# EAGLE design LED_BOARD (EAGLE 9.6.2)
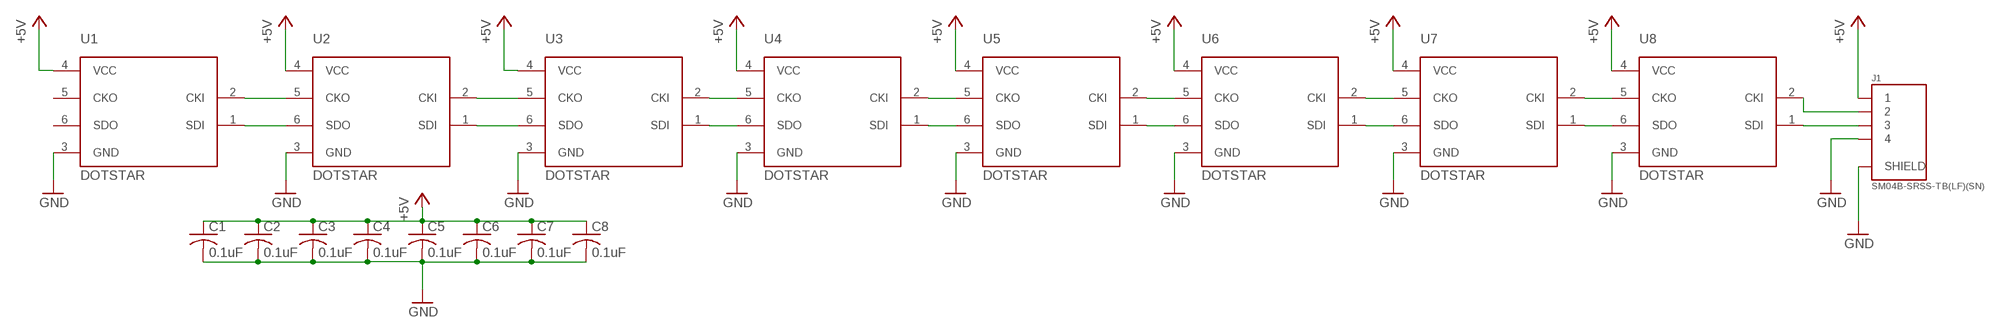
[diagram p0: schematic, sheet 1]

## Parts
C1  0.1uF  C-USC0603  [C0603]
C2  0.1uF  C-USC0603  [C0603]
C3  0.1uF  C-USC0603  [C0603]
C4  0.1uF  C-USC0603  [C0603]
C5  0.1uF  C-USC0603  [C0603]
C6  0.1uF  C-USC0603  [C0603]
C7  0.1uF  C-USC0603  [C0603]
C8  0.1uF  C-USC0603  [C0603]
J1  SM04B-SRSS-TB(LF)(SN)  [SM04B-SRSS-TB(LF)(SN)]
U1  DOTSTAR  [RGBLED5050]
U2  DOTSTAR  [RGBLED5050]
U3  DOTSTAR  [RGBLED5050]
U4  DOTSTAR  [RGBLED5050]
U5  DOTSTAR  [RGBLED5050]
U6  DOTSTAR  [RGBLED5050]
U7  DOTSTAR  [RGBLED5050]
U8  DOTSTAR  [RGBLED5050]

## Nets
+5V: C1.1 C2.1 C3.1 C4.1 C5.1 C6.1 C7.1 C8.1 J1.1 U1.4(VCC) U2.4(VCC) U3.4(VCC) U4.4(VCC) U5.4(VCC) U6.4(VCC) U7.4(VCC) U8.4(VCC)
GND: C1.2 C2.2 C3.2 C4.2 C5.2 C6.2 C7.2 C8.2 J1.4 J1.S1(SHIELD) J1.S2(SHIELD) U1.3(GND) U2.3(GND) U3.3(GND) U4.3(GND) U5.3(GND) U6.3(GND) U7.3(GND) U8.3(GND)
N$1: U1.2(CKI) U2.5(CKO)
N$2: U1.1(SDI) U2.6(SDO)
N$3: U2.2(CKI) U3.5(CKO)
N$4: U2.1(SDI) U3.6(SDO)
N$5: U3.2(CKI) U4.5(CKO)
N$6: U3.1(SDI) U4.6(SDO)
N$7: U4.2(CKI) U5.5(CKO)
N$8: U4.1(SDI) U5.6(SDO)
N$9: U5.2(CKI) U6.5(CKO)
N$10: U5.1(SDI) U6.6(SDO)
N$11: U6.2(CKI) U7.5(CKO)
N$12: U6.1(SDI) U7.6(SDO)
N$13: U7.2(CKI) U8.5(CKO)
N$14: U7.1(SDI) U8.6(SDO)
N$15: J1.2 U8.2(CKI)
N$16: J1.3 U8.1(SDI)
Unconnected: U1.5(CKO) U1.6(SDO)

## Library data of the parts
C1-C8 = rcl:C-US: CAPACITOR, American symbol; SPICEPREFIX: C
J1 = Hocki_Library:SM04B-SRSS-TB(LF)(SN): Connector Header Surface Mount, Right Angle 4 position 0.039" (1.00mm) DigiKey <https://www.digikey.com/product-detail/en/jst-sales-america-inc/SM04B-SRSS-TB-LF-SN/455-1804-1-ND/926875>; DKPN: 455-1804-1-ND
U1-U8 = LED_BOARD:DOTSTAR

## Board
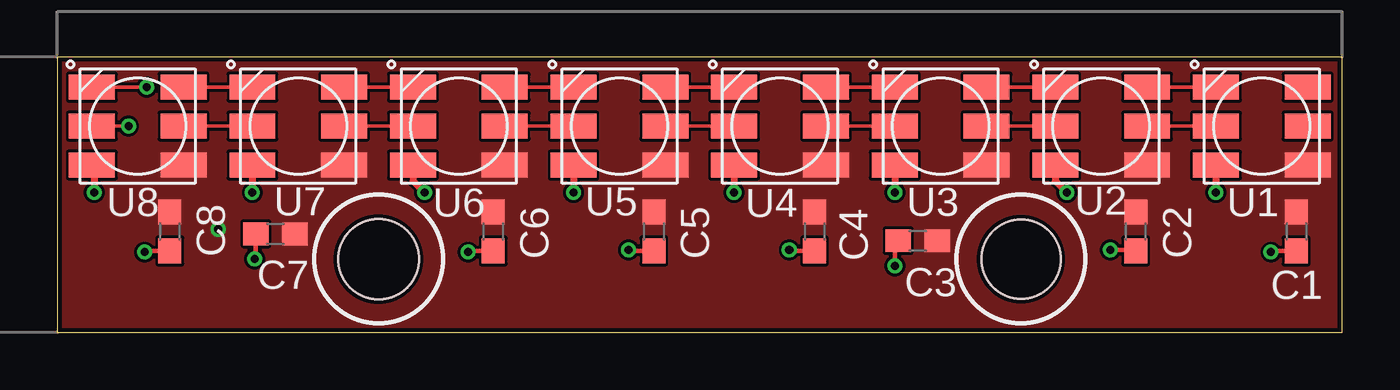
[diagram p1: board, top side]
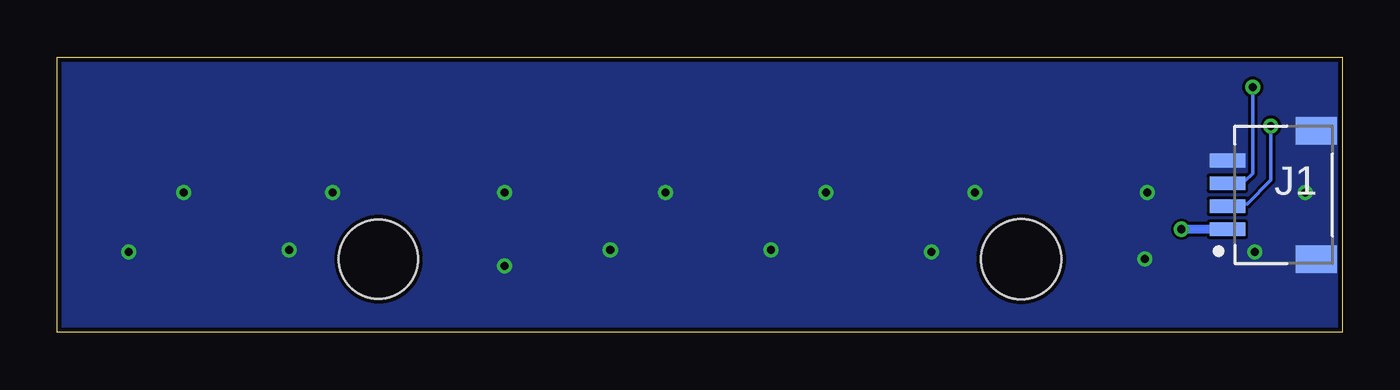
[diagram p2: board, bottom side, seen from below]

Size 56 x 12 mm. Coordinates in mm from the lower left corner, seen from the top.
Outline: 0,12 0,0 56,0 56,12 0,12
Copper layers (1+16): Top 0.035mm / dielectric 1.53mm / Bottom 0.035mm
Design rules "JLCPCB (2 Layer)": minimum track width 5mil, minimum drill 0.3mm, track to track 5mil, track to pad 5mil, pad to pad 5mil, via to via 20mil, smd to smd 5mil, copper to edge 0.2mm, drill to drill 21mil, minimum pad ring 6mil, minimum via ring 6mil, stop-mask expansion 6mil, vias tented up to drill 30mil, thermal gap 10mil
Holes 3.5 mm at 14,3.2
Holes 3.45 mm at 42,3.2

### Footprints (pad centres in the part's own frame; a part is rotated, then mirrored left to right if it is on the bottom)
C0603 = smd 1.1 x 1: 1 -0.85,0; 2 0.85,0
SM04B-SRSS-TB(LF)(SN) = smd 0.6 x 1.55: 1 -1.5,0; 2 -0.5,0; 3 0.5,0; 4 1.5,0 | smd 1.2 x 1.8: S1 -2.8,-3.875; S2 2.8,-3.875
RGBLED5050 = smd 2 x 1.1: 1 2,-1.7; 2 2,0; 3 2,1.7; 4 -2,1.7; 5 -2,0; 6 -2,-1.7

### Placement (x,y rotation side)
C1  54,4.4 270 top
C2  47,4.4 270 top
C3  37.5,4 180 top
C4  33,4.4 270 top
C5  26,4.4 270 top
C6  19,4.4 270 top
C7  9.5,4.3 180 top
C8  4.9,4.4 270 top
J1  5,6 90 bottom
U1  52.5,9 180 top
U2  45.5,9 180 top
U3  38.5,9 180 top
U4  31.5,9 180 top
U5  24.5,9 180 top
U6  17.5,9 180 top
U7  10.5,9 180 top
U8  3.5,9 180 top

### Tracks (layer width: path | path; a pad name or v marks a point on that pad's centre or on a via)
+5V  (via drill 0.35)
  Bottom 0.4: J1.1 v7,4.5
  pour Top (no thermals): 0,0 0,12 56,12 56,0
GND  (via drill 0.35)
  Top 0.2: C8.2 3.85,3.55 v3.8,3.5 | U8.3 1.6,7.2 | C1.2 52.95,3.55 v52.9,3.5 | C2.2 46.95,3.6 v45.9,3.6 | C3.2 36.5,3.85 v36.5,2.9 | C4.2 31.95,3.55 v31.9,3.6 | v24.9,3.6 24.95,3.55 C5.2 | C6.2 17.95,3.55 v17.9,3.5 | C7.2 8.65,3.3 v8.6,3.2
  Top 0.3: U1.3 v50.5,6.1 | v44,6.1 43.5,6.6 U2.3 | U3.3 v36.5,6.1 | U4.3 v29.5,6.1 | U5.3 v22.5,6.1 | U6.3 15.5,6.6 v16,6.1 | U7.3 v8.5,6.1 | 1.6,7.2 v1.6,6.1
  pour Bottom (no thermals): 56,12 56,0 0,0 0,12
N$1
  Top 0.152: U2.5 U1.2
N$2
  Top 0.152: U2.6 U1.1
N$3
  Top 0.152: U3.5 U2.2
N$4
  Top 0.152: U3.6 U2.1
N$5
  Top 0.152: U4.5 U3.2
N$6
  Top 0.152: U4.6 U3.1
N$7
  Top 0.152: U5.5 U4.2
N$8
  Top 0.152: U5.6 U4.1
N$9
  Top 0.152: U6.5 U5.2
N$10
  Top 0.152: U6.6 U5.1
N$11
  Top 0.152: U7.5 U6.2
N$12
  Top 0.152: U7.6 U6.1
N$13
  Top 0.152: U8.5 U7.2
N$14
  Top 0.152: U8.6 U7.1
N$15  (via drill 0.35)
  Top 0.152: U8.2 v3.1,9
  Bottom 0.152: J1.2 4.9,5.6 4.14,5.6 3.1,6.64 v3.1,9
N$16  (via drill 0.35)
  Top 0.152: U8.1 v3.9,10.7
  Bottom 0.152: J1.3 4.9,6.6 4.24,6.6 3.9,6.94 v3.9,10.7